# EAGLE design control_board_v2 (EAGLE 6.3)
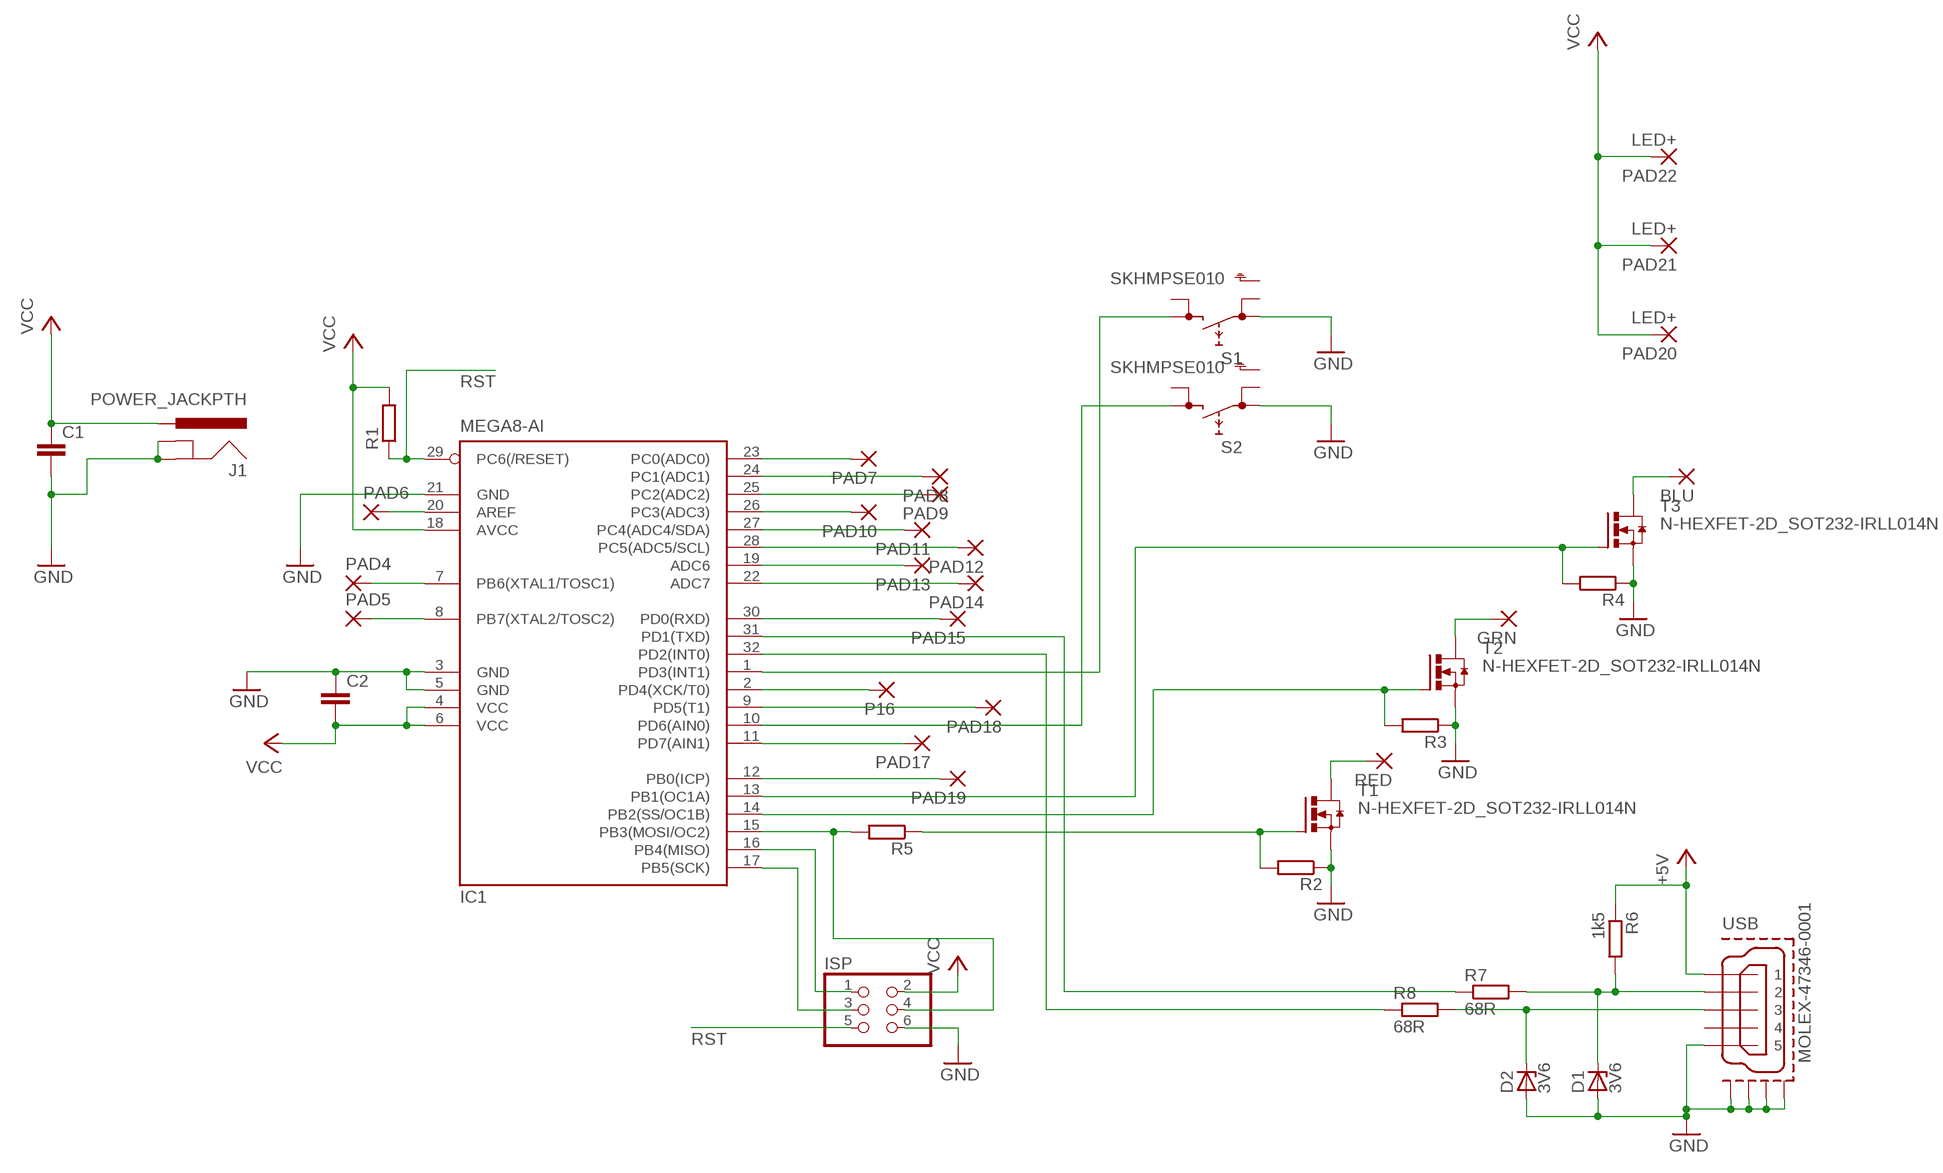
[diagram p0: schematic, sheet 1]

## Parts
BLU  2,54/1,0  [2,54/1,0]
C1  C-EUC0805  [C0805]
C2  C-EUC0805  [C0805]
D1  3V6  ZENER-DIODESOD80C  [SOD80C]
D2  3V6  ZENER-DIODESOD80C  [SOD80C]
GRN  2,54/1,0  [2,54/1,0]
IC1  MEGA8-AI  [TQFP32-08]
ISP  PINHD-2X3  [2X03]
J1  POWER_JACKPTH  [POWER_JACK_PTH]
P16  1,6/0,9  [1,6/0,9]
PAD4  1,6/0,9  [1,6/0,9]
PAD5  1,6/0,9  [1,6/0,9]
PAD6  1,6/0,9  [1,6/0,9]
PAD7  1,6/0,9  [1,6/0,9]
PAD8  1,6/0,9  [1,6/0,9]
PAD9  1,6/0,9  [1,6/0,9]
PAD10  1,6/0,9  [1,6/0,9]
PAD11  1,6/0,9  [1,6/0,9]
PAD12  1,6/0,9  [1,6/0,9]
PAD13  1,6/0,9  [1,6/0,9]
PAD14  1,6/0,9  [1,6/0,9]
PAD15  1,6/0,9  [1,6/0,9]
PAD17  1,6/0,9  [1,6/0,9]
PAD18  1,6/0,9  [1,6/0,9]
PAD19  1,6/0,9  [1,6/0,9]
PAD20  LED+  2,54/1,0  [2,54/1,0]
PAD21  LED+  2,54/1,0  [2,54/1,0]
PAD22  LED+  2,54/1,0  [2,54/1,0]
R1  R-EU_R0805  [R0805]
R2  R-EU_R0805  [R0805]
R3  R-EU_R0805  [R0805]
R4  R-EU_R0805  [R0805]
R5  R-EU_R0805  [R0805]
R6  1k5  R-EU_R0805  [R0805]
R7  68R  R-EU_R0805  [R0805]
R8  68R  R-EU_R0805  [R0805]
RED  2,54/1,0  [2,54/1,0]
S1  SKHMPSE010  [SKHMPXE010]
S2  SKHMPSE010  [SKHMPXE010]
T1  N-HEXFET-2D_SOT232-IRLL014N  [SOT223]
T2  N-HEXFET-2D_SOT232-IRLL014N  [SOT223]
T3  N-HEXFET-2D_SOT232-IRLL014N  [SOT223]
USB  MOLEX-47346-0001  [MOLEX-47364-0001]

## Nets
+5V: R6.1 USB.1
GND: C1.2 C2.1 D1.A D2.A IC1.3(GND) IC1.5(GND) IC1.21(GND) ISP.6 J1.GND J1.GNDBREAK R2.1 R3.1 R4.1 S1.1(1.1) S2.1(1.1) T1.3(S) T2.3(S) T3.3(S) USB.5 USB.GND1 USB.GND2 USB.GND3 USB.GND4
N$1: IC1.16(PB4(MISO)) ISP.1
N$2: IC1.15(PB3(MOSI/OC2)) ISP.4 R5.2
N$3: RED.1(P) T1.2(D) T1.4(D)
N$4: IC1.14(PB2(SS/OC1B)) R3.2 T2.1(G)
N$5: GRN.1(P) T2.2(D) T2.4(D)
N$6: IC1.13(PB1(OC1A)) R4.2 T3.1(G)
N$7: BLU.1(P) T3.2(D) T3.4(D)
N$8: IC1.10(PD6(AIN0)) S2.3(2.1)
N$9: IC1.1(PD3(INT1)) S1.3(2.1)
N$10: IC1.31(PD1(TXD)) R7.1
N$11: IC1.32(PD2(INT0)) R8.1
N$12: R2.2 R5.1 T1.1(G)
N$13: IC1.17(PB5(SCK)) ISP.3
N$14: IC1.20(AREF) PAD6.1(P)
N$15: IC1.23(PC0(ADC0)) PAD7.1(P)
N$16: IC1.24(PC1(ADC1)) PAD8.1(P)
N$17: IC1.25(PC2(ADC2)) PAD9.1(P)
N$18: IC1.26(PC3(ADC3)) PAD10.1(P)
N$19: IC1.27(PC4(ADC4/SDA)) PAD11.1(P)
N$20: IC1.28(PC5(ADC5/SCL)) PAD12.1(P)
N$21: IC1.19(ADC6) PAD13.1(P)
N$22: IC1.22(ADC7) PAD14.1(P)
N$23: IC1.30(PD0(RXD)) PAD15.1(P)
N$24: IC1.2(PD4(XCK/T0)) P16.1(P)
N$25: IC1.11(PD7(AIN1)) PAD17.1(P)
N$26: IC1.9(PD5(T1)) PAD18.1(P)
N$27: IC1.12(PB0(ICP)) PAD19.1(P)
N$28: IC1.7(PB6(XTAL1/TOSC1)) PAD4.1(P)
N$29: IC1.8(PB7(XTAL2/TOSC2)) PAD5.1(P)
N$30: D1.C R6.2 R7.2 USB.2
N$31: D2.C R8.2 USB.3
RST: IC1.29(PC6(/RESET)) ISP.5 R1.1
VCC: C1.1 C2.2 IC1.4(VCC) IC1.6(VCC) IC1.18(AVCC) ISP.2 J1.PWR PAD20.1(P) PAD21.1(P) PAD22.1(P) R1.2
Unconnected: S1.2(1.2) S1.4(2.2) S1.5(SH) S2.2(1.2) S2.4(2.2) S2.5(SH) USB.4

## Notes on the sheet
- RST
- RST

## Library data of the parts
BLU GRN PAD20-PAD22 RED = wirepad:2,54/1,0: THROUGH-HOLE PAD
C1 C2 = resistor:C-EU: CAPACITOR, European symbol
D1 D2 = diode:ZENER-DIODE: Z-Diode
IC1 = atmel:MEGA8: MICROCONTROLLER 8 Kbytes FLASH, 1 kbytes SRAM, 512 bytes EEPROM, USART, 6-channel 10 bit ADC, 2-channel 8 bit ADC Pin compatible with Atmega48, ATMega88, ATMega168 Source: avr.lbr; MPN: ATMEGA8-16AU; OC_FARNELL: 9171371; OC_NEWARK: 73M8863
ISP = pinhead:PINHD-2X3: PIN HEADER
J1 = SparkFun:POWER_JACK: Power Jack This is the standard 5.5mm barrel jack for power. The PTH is the most common, proven, reliable, footprint. All others are experimental. The Slot footprint only works if the mill layer is transmitted to the PCB fab house so be warned. Spark Fun Electronics SKU : PRT-00119. Mating wall wart : TOL-00298 (and others)
P16 PAD4-PAD15 PAD17-PAD19 = wirepad:1,6/0,9: THROUGH-HOLE PAD
R1-R8 = resistor:R-EU_: RESISTOR, European symbol
S1 S2 = switch:SKHMP*E010: 6.2 X 6.5mm TACT Switch (SMD) Source: http://www3.alps.co.jp/WebObjects/catalog.woa/PDF/E/Switch/Tact/SKHM/SKHM.PDF
T1-T3 = transistor-power:N-HEXFET-2D_?-*: HEXFET® Power MOSFET 2 Drain connects http://www.irf.com/product-info/datasheets/data/irll014n.pdf
USB = usb_con-update:MOLEX-47346-0001: MICRO USB B, BOTTOM MOUNT

## Board
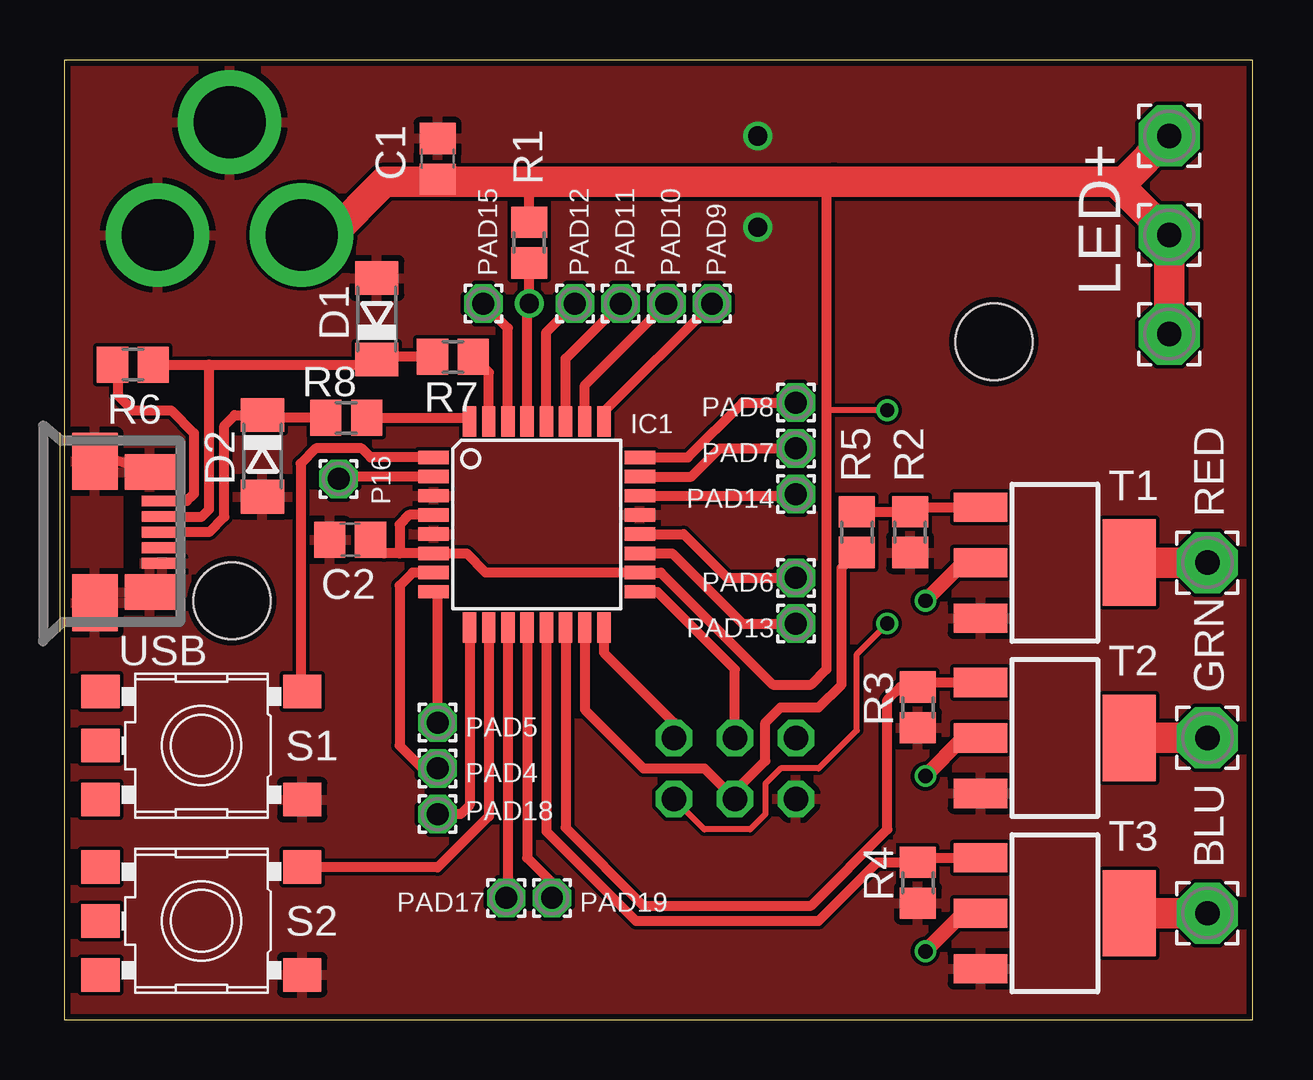
[diagram p1: board, top side]
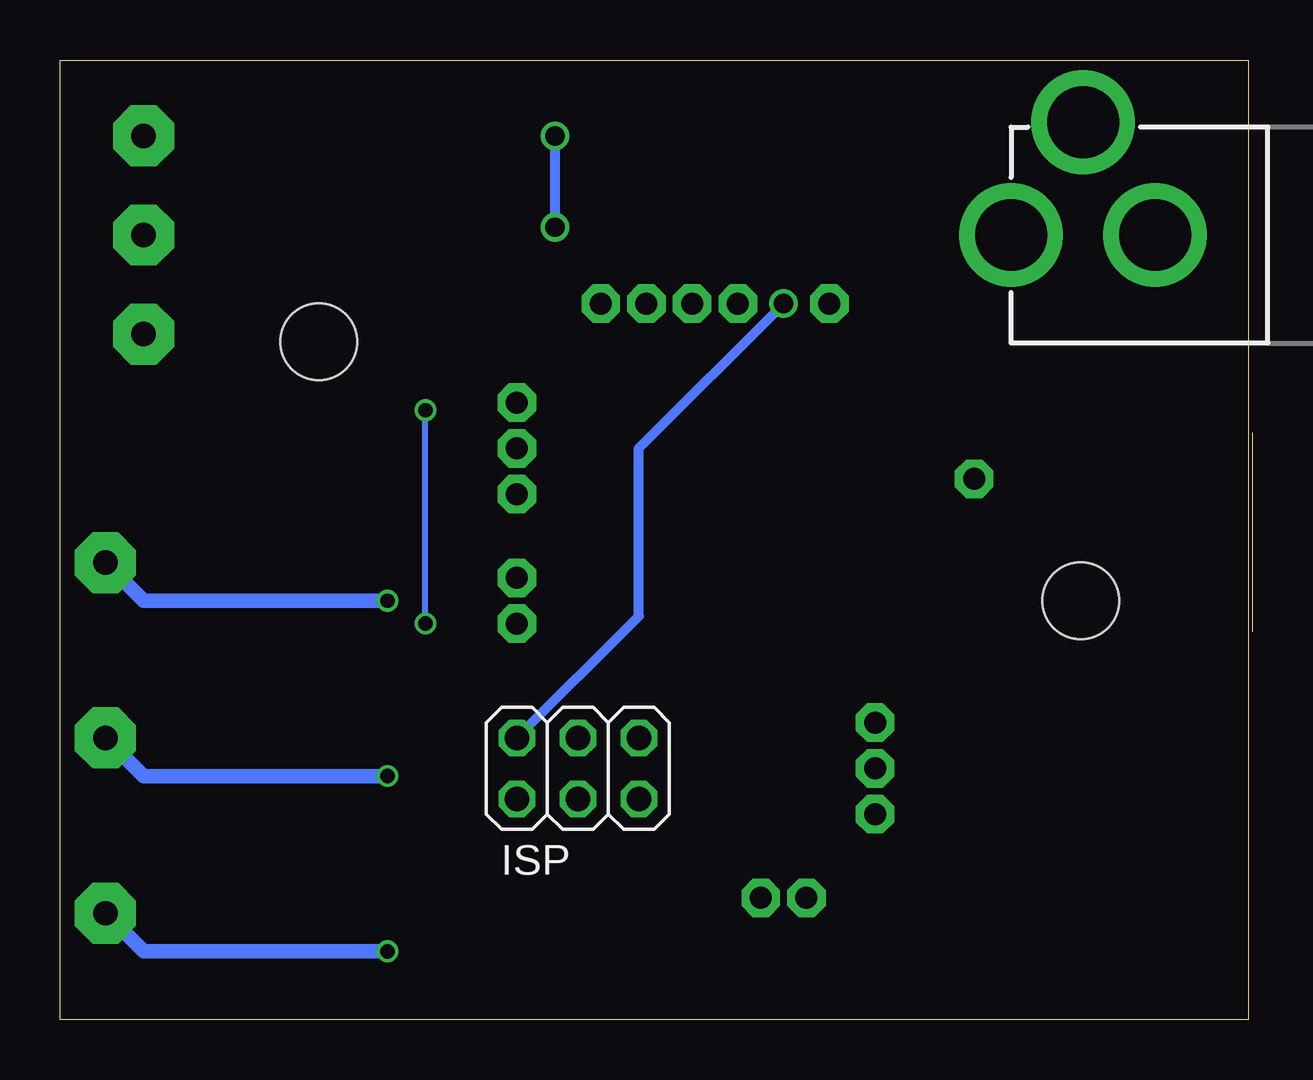
[diagram p2: board, bottom side, seen from below]

Size 49.52 x 39.99 mm. Coordinates in mm from the lower left corner, seen from the top.
Outline: 0,0 49.52,0 49.52,39.99 0,39.99 0,0
Copper layers (1*16): Top 0.035mm / dielectric 1.5mm / Bottom 0.035mm
Design rules "Fusion_eagle_rule_v1.1": minimum track width 6mil, minimum drill 12mil, track to track 6mil, track to pad 6mil, pad to pad 6mil, via to via 6mil, smd to smd 0mil, copper to edge 10mil, drill to drill 10mil, minimum pad ring 10mil, minimum via ring 6mil, stop-mask expansion 2mil, vias tented up to drill 100mil, thermal gap 10mil
Holes 3.2 mm at 6.99,17.46 38.73,28.26

### Footprints (pad centres in the part's own frame; a part is rotated, then mirrored left to right if it is on the bottom)
2,54/1,0 = drill 1.016 pad 2.54 octagon: 1 0,0
C0805 = smd 1.3 x 1.5: 1 -0.85,0; 2 0.85,0
SOD80C = smd 1.4 x 1.8: A 1.7,0; C -1.7,0
TQFP32-08 = smd 1.27 x 0.559: 1 -4.293,2.8; 2 -4.293,2; 3 -4.293,1.2; 4 -4.293,0.4; 5 -4.293,-0.4; 6 -4.293,-1.2; 7 -4.293,-2; 8 -4.293,-2.8; 17 4.293,-2.8; 18 4.293,-2; 19 4.293,-1.2; 20 4.293,-0.4; 21 4.293,0.4; 22 4.293,1.2; 23 4.293,2; 24 4.293,2.8 | smd 0.559 x 1.27: 9 -2.8,-4.293; 10 -2,-4.293; 11 -1.2,-4.293; 12 -0.4,-4.293; 13 0.4,-4.293; 14 1.2,-4.293; 15 2,-4.293; 16 2.8,-4.293; 25 2.8,4.293; 26 2,4.293; 27 1.2,4.293; 28 0.4,4.293; 29 -0.4,4.293; 30 -1.2,4.293; 31 -2,4.293; 32 -2.8,4.293
2X03 = drill 1.016 octagon: 1 -2.54,-1.27; 2 -2.54,1.27; 3 0,-1.27; 4 0,1.27; 5 2.54,-1.27; 6 2.54,1.27
POWER_JACK_PTH = drill 2.997 pad 4.318: GND 0,7.7; GNDBREAK 4.7,10.7; PWR 0,13.7
1,6/0,9 = drill 0.914 pad 1.6 octagon: 1 0,0
R0805 = smd 1.3 x 1.5: 1 -0.85,0; 2 0.85,0
SKHMPXE010 = smd 1.6 x 1.4: 1 -4.2,2.25; 2 4.2,2.25; 3 -4.2,-2.25; 4 4.2,-2.25; 5 4.2,0
SOT223 = smd 1.219 x 2.235: 1 -2.311,-3.099; 2 0,-3.099; 3 2.311,-3.099 | smd 3.6 x 2.2: 4 0,3.099
MOLEX-47364-0001 = smd 1.7 x 0.45: 1 2.8,1.3; 2 2.8,0.65; 3 2.8,0; 4 2.8,-0.65; 5 2.8,-1.3 | smd 1.9 x 2.375: GND1 0,2.95; GND4 0,-2.95 | smd 2.1 x 1.475: GND2 2.3,2.5; GND3 2.3,-2.5

### Placement (x,y rotation side)
BLU  47.62,4.45 0 top
C1  15.56,35.88 90 top
C2  11.91,20 0 top
D1  13.02,29.21 90 top
D2  8.26,23.5 270 top
GRN  47.62,11.75 0 top
IC1  19.68,20.64 0 top
ISP  27.94,10.48 180 bottom
J1  -3.81,32.7 90 bottom
P16  11.43,22.54 0 top
PAD4  15.56,10.48 0 top
PAD5  15.56,12.38 0 top
PAD6  30.48,18.41 0 top
PAD7  30.48,23.81 0 top
PAD8  30.48,25.72 0 top
PAD9  26.99,29.84 0 top
PAD10  25.08,29.84 0 top
PAD11  23.18,29.84 0 top
PAD12  21.27,29.84 0 top
PAD13  30.48,16.51 0 top
PAD14  30.48,21.91 0 top
PAD15  17.46,29.84 0 top
PAD17  18.41,5.08 0 top
PAD18  15.56,8.57 0 top
PAD19  20.32,5.08 0 top
PAD20  46.04,36.83 90 top
PAD21  46.04,32.7 90 top
PAD22  46.04,28.57 90 top
R1  19.37,32.38 90 top
R2  35.24,20.32 90 top
R3  35.56,13.02 90 top
R4  35.56,5.71 90 top
R5  33.02,20.32 270 top
R6  2.86,27.3 0 top
R7  16.19,27.62 180 top
R8  11.75,25.08 180 top
RED  47.62,19.05 0 top
S1  5.71,11.43 180 top
S2  5.71,4.13 180 top
T1  41.27,19.05 270 top
T2  41.27,11.75 270 top
T3  41.27,4.45 270 top
USB  1.27,20.32 0 top

### Tracks (layer width: path | path; a pad name or v marks a point on that pad's centre or on a via)
+5V
  Top 0.406: USB.1 5.11,21.62 5.4,21.91 5.4,24.45 4.45,25.4 2.86,25.4 2.22,26.04 2.22,27.09 R6.1
GND  (via drill 0.8)
  Top 0.406: USB.GND2 1.72,23.45 USB.GND1
  Bottom 0.406: v28.89,33.02 v28.89,36.83
  pour Top: -0.95,-0.64 50.48,-0.64 50.16,40.64 -0.95,40.96
N$1
  Top 0.406: IC1.16 22.48,15.3 25.4,12.38 ISP.1
N$2
  Top 0.406: IC1.15 21.68,12.92 24.13,10.48 26.67,10.48 ISP.4 27.94,9.53 29.21,10.79 29.21,12.38 29.84,13.02 31.43,13.02 32.38,13.97 32.38,18.84 R5.2
N$3  (via drill 0.6)
  Top 0.61: T1.2 37.47,19.05 v35.88,17.46
  Top 1.27: RED.1 T1.4
  Bottom 0.61: v35.88,17.46 46.04,17.46 RED.1
N$4
  Top 0.406: IC1.14 20.89,8.01 24.13,4.76 31.11,4.76 34.29,7.94 34.29,13.34 34.82,13.87 R3.2 35.75,14.06 T2.1 37.29,14.12
N$5  (via drill 0.6)
  Top 0.406: 47.94,11.75 GRN.1
  Top 0.61: T2.2 37.47,11.75 v35.88,10.16
  Top 1.27: GRN.1 T2.4
  Bottom 0.61: v35.88,10.16 46.04,10.16 GRN.1
N$6
  Top 0.406: IC1.13 20.09,7.86 23.81,4.13 31.43,4.13 33.87,6.57 R4.2 35.75,6.76 T3.1
N$7  (via drill 0.6)
  Top 0.61: T3.2 37.47,4.45 v35.88,2.86
  Top 1.27: BLU.1 T3.4
  Bottom 0.61: v35.88,2.86 46.04,2.86 BLU.1
N$8
  Top 0.406: IC1.10 17.68,8.48 15.56,6.35 9.94,6.35 S2.3
N$9
  Top 0.406: IC1.1 12.76,23.44 12.38,23.81 10.48,23.81 9.84,23.18 9.84,13.75 S1.3
N$10
  Top 0.406: IC1.31 17.68,26.98 R7.1
N$11
  Top 0.406: R8.1 16.73,25.08 IC1.32
N$12
  Top 0.406: R5.1 R2.2 35.75,21.36 T1.1
N$13
  Top 0.406: IC1.17 24.71,17.84 27.94,14.61 ISP.3
N$14
  Top 0.406: IC1.20 25.8,20.24 27.62,18.41 PAD6.1
N$15
  Top 0.406: IC1.23 26.13,22.64 27.3,23.81 PAD7.1
N$16
  Top 0.406: IC1.24 25.98,23.44 28.26,25.72 PAD8.1
N$17
  Top 0.406: IC1.25 22.48,25.34 PAD9.1
N$18
  Top 0.406: IC1.26 21.68,26.45 PAD10.1
N$19
  Top 0.406: IC1.27 20.89,27.55 PAD11.1
N$20
  Top 0.406: IC1.28 20.09,28.66 PAD12.1
N$21
  Top 0.406: IC1.19 25.33,19.44 28.26,16.51 PAD13.1
N$22
  Top 0.406: IC1.22 30.41,21.84 PAD14.1
N$23
  Top 0.406: IC1.30 18.48,28.82 PAD15.1
N$24
  Top 0.406: IC1.2 11.53,22.64 P16.1
N$25
  Top 0.406: IC1.11 18.48,5.15 PAD17.1
N$26
  Top 0.406: IC1.9 16.89,8.95 16.51,8.57 PAD18.1
N$27
  Top 0.406: IC1.12 19.29,6.75 20.32,5.71 PAD19.1
N$28
  Top 0.406: IC1.7 14.51,18.64 13.97,18.1 13.97,11.43 14.92,10.48 PAD4.1
N$29
  Top 0.406: PAD5.1 15.56,17.67 IC1.8
N$30
  Top 0.406: R7.2 13.13,27.62 D1.C 12.81,27.3 6.03,27.3 | USB.2 5.73,20.97 6.03,21.27 6.03,27.3 | R6.2 6.03,27.3
N$31
  Top 0.406: R8.2 8.37,25.08 D2.C | D2.C 8.05,25.2 | USB.3 6.03,20.32 6.67,20.95 6.67,24.77 7.1,25.2 D2.C
RST  (via drill 0.8)
  Top 0.406: 19.29,31.45 R1.1 v19.37,29.84 19.29,29.76 IC1.29
  Bottom 0.406: v19.37,29.84 25.4,23.81 25.4,16.83 ISP.5
VCC  (via drill 0.6)
  Top 0.254: ISP.2 26.67,7.94 28.57,7.94 29.21,8.57 29.21,9.84 29.84,10.48 31.43,10.48 33.02,12.06 33.02,15.24 v34.29,16.51 | v34.29,25.4 31.75,25.4
  Top 0.406: 13.97,19.44 IC1.6 16.76,19.44 17.56,18.64 IC1.18 24.86,18.64 29.53,13.97 31.11,13.97 31.75,14.61 31.75,25.4 31.75,34.61 32.07,34.92 19.37,34.92 R1.2 19.37,34.61 19.68,34.92 | 13.97,19.44 13.32,19.44 C2.2 | C1.1 15.77,35.03 | IC1.4 14.37,21.04 13.97,20.64 13.97,19.44
  Top 1.27: 16.09,34.92 19.37,34.92 19.68,34.92 32.07,34.92 43.81,34.92 | 43.81,34.92 PAD21.1 PAD22.1 | 43.81,34.92 44.13,34.92 PAD20.1 | J1.PWR 11.11,32.7 13.34,34.92 16.09,34.92 | C1.1 16.09,34.92
  Bottom 0.254: v34.29,16.51 v34.29,25.4

### Text on the board
tNames: LED+
bDocu: moodlamp v2 | by Nephirus | brmlab | hackerspace prague | http://nephirus.cz/moodlamp | rev 01